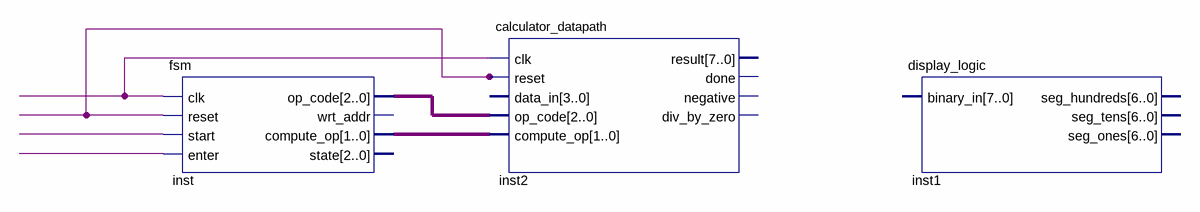
[diagram p0: schematic sheet]
// Quartus schematic Block3.bdf as structural Verilog: 3 symbols, 0 pins
module Block3 (
);

  wire undriven, undriven_2, undriven_3, undriven_4;
  wire [1:0] inst_compute_op;
  wire [2:0] inst_op_code;

  fsm inst (
    .clk(undriven_3), .reset(undriven_4), .start(undriven), .enter(undriven_2), .op_code(inst_op_code),
    .compute_op(inst_compute_op));  // open: wrt_addr, state
  calculator_datapath inst2 (
    .clk(undriven_3), .reset(undriven_4), .op_code(inst_op_code), .compute_op(inst_compute_op));  // open: data_in, result, done, negative, div_by_zero
  display_logic inst1 ();  // open: binary_in, seg_hundreds, seg_tens, seg_ones
endmodule
